# EAGLE design LoRa_1W_Breakout (EAGLE 9.6.2)
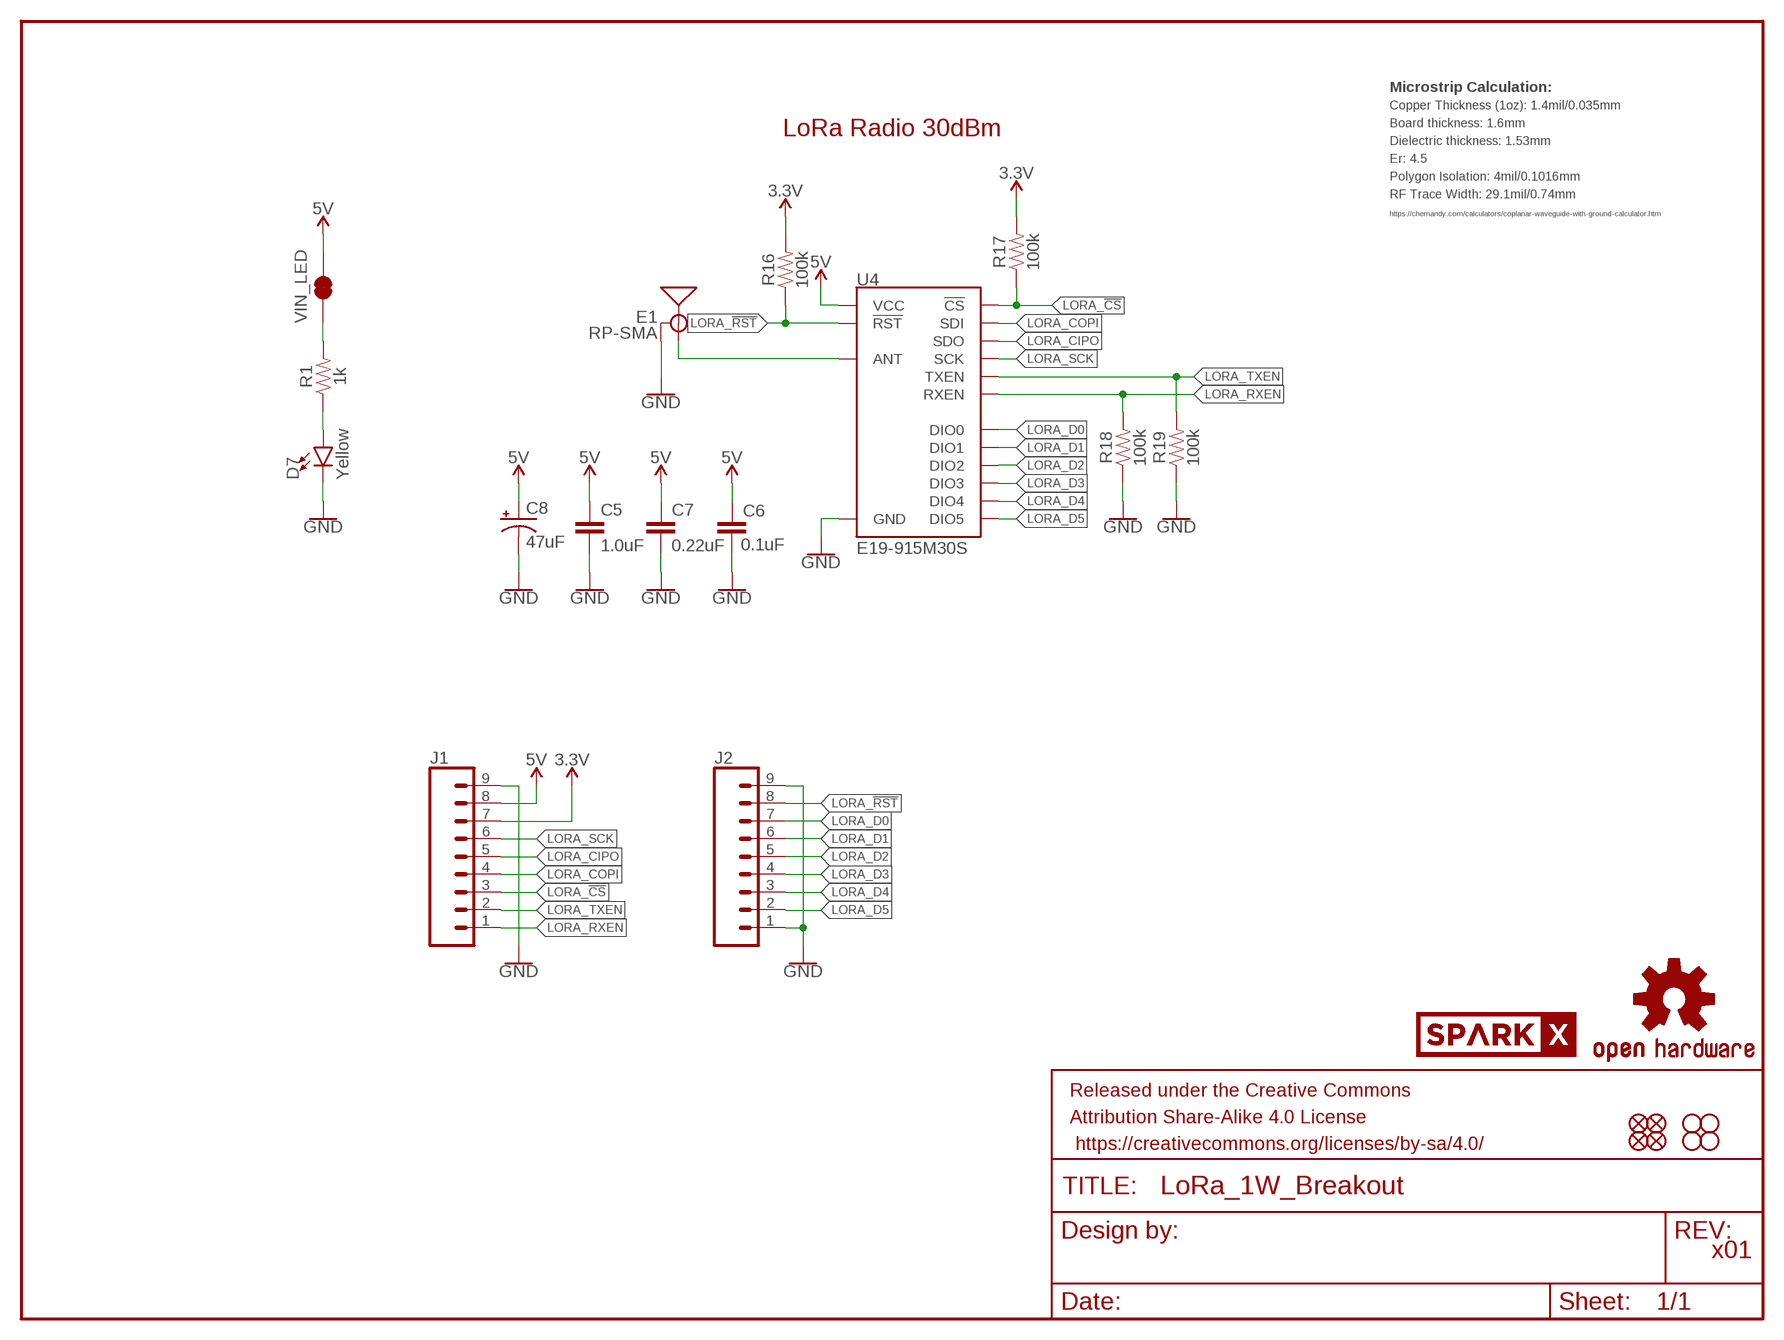
[diagram p0: schematic, sheet 1]

## Parts
C5  1.0uF  1.0UF-0603-16V-10%  [0603]
C6  0.1uF  0.1UF-0603-25V-(+80/-20%)  [0603]
C7  0.22uF  0.22UF-0603-25V-10%  [0603]
C8  47uF  47UF-POLAR-EIA3528-10V-10%  [EIA3528]
D7  Yellow  LED-YELLOW0603  [LED-0603]
E1  RP-SMA  ANTENNA-SMA-GROUNDEDEDGE_RPSMA  [SMA-EDGE]
FD1  FIDUCIALUFIDUCIAL  [FIDUCIAL-MICRO]
FD2  FIDUCIALUFIDUCIAL  [FIDUCIAL-MICRO]
FD3  FIDUCIALUFIDUCIAL  [FIDUCIAL-MICRO]
FD4  FIDUCIALUFIDUCIAL  [FIDUCIAL-MICRO]
FRAME2  FRAME-LETTER  [CREATIVE_COMMONS]
H1  STAND-OFF  [STAND-OFF]
H2  STAND-OFF  [STAND-OFF]
H3  STAND-OFF  [STAND-OFF]
H4  STAND-OFF  [STAND-OFF]
J1  CONN_09NO_SILK  [1X09_NO_SILK]
J2  CONN_09NO_SILK  [1X09_NO_SILK]
LOGO3  OSHW-LOGOMINI  [OSHW-LOGO-MINI]
R1  1k  1KOHM-0603-1/10W-1%  [0603]
R16  100k  100KOHM-0603-1/10W-1%  [0603]
R17  100k  100KOHM-0603-1/10W-1%  [0603]
R18  100k  100KOHM-0603-1/10W-1%  [0603]
R19  100k  100KOHM-0603-1/10W-1%  [0603]
U4  E19-915M30S  E19-915MS1W  [E19-915MS1W]
U$5  SPARKX-LOGO5  [SPARKX-LARGE]
VIN_LED  JUMPER-SMT_2_NC_TRACE_SILK  [SMT-JUMPER_2_NC_TRACE_SILK]

## Nets
3.3V: J1.7 R16.2 R17.2
5V: C5.1 C6.1 C7.1 C8.A(+) J1.8 U4.11(VCC) VIN_LED.2
GND: C5.2 C6.2 C7.2 C8.C(-) D7.C E1.GND@0(GND) E1.GND@1(GND) E1.GND@2(GND) E1.GND@3(GND) J1.9 J2.1 J2.9 R18.1 R19.1 U4.1(GND) U4.9(GND) U4.10(GND) U4.18(GND) U4.20(GND) U4.21(GND) U4.22(GND)
LORA_!CS!: J1.3 R17.1 U4.15(!CS)
LORA_!RST!: J2.8 R16.1 U4.8(!RST)
LORA_CIPO: J1.5 U4.13(SDO)
LORA_COPI: J1.4 U4.14(SDI)
LORA_D0: J2.7 U4.7(DIO0)
LORA_D1: J2.6 U4.6(DIO1)
LORA_D2: J2.5 U4.5(DIO2)
LORA_D3: J2.4 U4.4(DIO3)
LORA_D4: J2.3 U4.3(DIO4)
LORA_D5: J2.2 U4.2(DIO5)
LORA_RF: E1.SIG(SIGNAL) U4.19(ANT)
LORA_RXEN: J1.1 R18.2 U4.17(RXEN)
LORA_SCK: J1.6 U4.12(SCK)
LORA_TXEN: J1.2 R19.2 U4.16(TXEN)
N$8: R1.2 VIN_LED.1
N$9: D7.A R1.1

## Notes on the sheet
- Microstrip Calculation:
- Copper Thickness (1oz): 1.4mil/0.035mm
- LoRa Radio 30dBm | Board thickness: 1.6mm
- Dielectric thickness: 1.53mm
- Er: 4.5
- Polygon Isolation: 4mil/0.1016mm
- RF Trace Width: 29.1mil/0.74mm
- https://chemandy.com/calculators/coplanar-waveguide-with-ground-calculator.htm
- x01

## Library data of the parts
C5 = SparkFun-Capacitors:1.0UF: 1µF ceramic capacitors A capacitor is a passive two-terminal electrical component used to store electrical energy temporarily in an electric field.; PROD_ID: CAP-00868
C6 = SparkFun-Capacitors:0.1UF: 0.1µF ceramic capacitors A capacitor is a passive two-terminal electrical component used to store electrical energy temporarily in an electric field.; PROD_ID: CAP-00810
C7 = SparkFun-Capacitors:0.22UF: 0.22µF ceramic capacitors A capacitor is a passive two-terminal electrical component used to store electrical energy temporarily in an electric field.; PROD_ID: CAP-07822
C8 = SparkFun-Capacitors:47UF-POLAR: 47µF polarized capacitors A capacitor is a passive two-terminal electrical component used to store electrical energy temporarily in an electric field.; PROD_ID: CAP-08310
D7 = SparkFun-LED:LED-YELLOW: Yellow SMD LED Used in manufacturing several products at SparkFun. Packages: 0603 - SMD 0603 package[Product Link] <http://www.kingbrightusa.com/product.asp?catalog_name=LED&product_id=APT1608SYCK> 0603 -SMART - SMART SMD 0603 package (more efficient/more expensive) [Product Link] <http://www.osram-os.com/osram_os/en/products/product-catalog/led-light-emitting-diodes/smartled-0603/ly-l29k/index.jsp> LilyPad - SMD1206 package[Product Datasheet] <https://www.sparkfun.com/datasheets/DevTools/LilyPad/Q150YUS4.pdf> SparkFun Products: Blynk Board <https://www.sparkfun.com/products/13794> IOIO-OTG <https://www.sparkfun.com/products/13613> XBee Explorer Serial <https://www.sparkfun.com/products/13225>; PROD_ID: DIO-09003
E1 = SparkFun-RF:ANTENNA-SMA-GROUNDED: SMA Antenna Connector w/ Ground Edge-mount and SMD SMA connectors for RF Antennas. **4-LAYER BOARD WARNING!!** When designing a 4-layer board using any of the SMD variants, you will need to manually add a cutout polygon on any internal power layers to make sure that you don't end up with exposed copper around the edge of the routed hole for these connectors. Exposed power copper could then short to the connector body - and that would be bad. Why hasn't anyone added the cutout polygons directly to the connector footprint? Well, your internal layers (usually 2 and 15) may be covered with GND polygons and you might well want the copper to go all the way to the edge, especially under the connector SIGNAL pin. So adding cutouts to the footprint might make matters worse, not better...; PROD_ID: CONN-00827
FD1-FD4 = SparkFun-Aesthetics:FIDUCIAL: Fiducial Alignment Points Point-of-reference for pick-and-place machines and other optical instruments.
FRAME2 = SparkFun-Aesthetics:FRAME-LETTER: Schematic Frame - Letter Standard 8.5x11 US Letter frame
H1-H4 = SparkFun-Hardware:STAND-OFF: Stand Off Drill holes for mechanically mounting via screws, standoffs, etc. Note: Use the keepout ring to avoid running the screw head into surrounding components. Variant Overviews STAND-OFF - Mechanical footprint for a #4 phillips button head screw. STAND-OFF-TIGHT - Mechanical footprint for a #4 phillips button head screw, Example SparkFun Products Screw - Phillips Head (1/4", 4-40, 10 pack) <https://www.sparkfun.com/products/10453> (PRT-10453) Screw - Phillips Head (1/2", 4-40, 10 pack) <https://www.sparkfun.com/products/10452> (PRT-10452) Screw - Phillips Head (3/4", 4-40, 10 pack) <https://www.sparkfun.com/products/10451> (PRT-10451) Screw - Phillips Head (1", 4-40, 10 pack) <https://www.sparkfun.com/products/10450> (PRT-10450)
J1 J2 = SparkFun-Connectors:CONN_09: Multi connection point. Often used as Generic Header-pin footprint for 0.1 inch spaced/style header connections On any of the 0.1 inch spaced packages, you can populate with these: Break Away Headers - Straight <https://www.sparkfun.com/products/116> (PRT-00116) Break Away Male Headers - Right Angle <https://www.sparkfun.com/products/553> (PRT-00553) Female Headers <https://www.sparkfun.com/products/115> (PRT-00115) Break Away Headers - Machine Pin <https://www.sparkfun.com/products/117> (PRT-00117) Break Away Female Headers - Swiss Machine Pin <https://www.sparkfun.com/products/743> (PRT-00743) For SCREWTERMINALS and SPRING TERMINALS visit here: Screw Terimnals on SparkFun.com <https://www.sparkfun.com/search/results?term=Screw+Terminals> (5mm/3.5mm/2.54mm spacing) This device is also useful as a general connection point to wire up your design to another part of your project. Our various solder wires solder well into these plated through hole pads. Hook-Up Wire - Assortment (Stranded, 22 AWG) <https://www.sparkfun.com/products/11375> (PRT-11375) Hook-Up Wire - Assortment (Solid Core, 22 AWG) <https://www.sparkfun.com/products/11367> (PRT-11367) View the entire wire category on our website here <https://www.sparkfun.com/categories/141> Special notes: Molex polarized connector foot print use with SKU : PRT-08231 with associated crimp pins and housings. 1MM SMD Version SKU: PRT-10208 NOTES ON THE VARIANTS LOCK and LOCK_LONGPADS... This footprint was designed to help hold the alignment of a through-hole component (i.e. 6-pin header) while soldering it into place. You may notice that each hole has been shifted either up or down by 0.005 of an inch from it's more standard position (which is a perfectly straight line). This slight alteration caused the pins (the squares in the middle) to touch the edges of the holes. Because they are alternating, it causes a "brace" to hold the component in place. 0.005 has proven to be the perfect amount of "off-center" position when using our standard breakaway headers. Although looks a little odd when you look at the bare footprint, once you have a header in there, the alteration is very hard to notice. Also,if you push a header all the way into place, it is covered up entirely on the bottom side.
LOGO3 = SparkFun-Aesthetics:OSHW-LOGO: Open-Source Hardware (OSHW) Logo This logo indicates the piece of hardware it is found on incorporates a OSHW license and/or adheres to the definition of open source hardware found here: http://freedomdefined.org/OSHW
R1 = SparkFun-Resistors:1KOHM: 1kΩ resistor A resistor is a passive two-terminal electrical component that implements electrical resistance as a circuit element. Resistors act to reduce current flow, and, at the same time, act to lower voltage levels within circuits. - Wikipedia; PROD_ID: RES-07856
R16-R19 = SparkFun-Resistors:100KOHM: 100kΩ resistor A resistor is a passive two-terminal electrical component that implements electrical resistance as a circuit element. Resistors act to reduce current flow, and, at the same time, act to lower voltage levels within circuits. - Wikipedia; PROD_ID: RES-07828
U4 = SparkFun-RF:E19-915MS1W: Chengdu Ebyte E19-915M30S - 915M LoRa (FSK) TRX Using SX1276 This is a 915 MHz LoRa (or optionally FSK) modulated transciver bassed on the Semtech SX1276. It has a high ouput power of 1W an a pre-installed U.FL connector. Can be used with LoRa WAN with DIO0, DIO1, and DIO2 hooked up to controller interrupt inputs SparkFun Products: SAMD21 Pro RF 1W <https://www.sparkfun.com/products/15034>; PROD_ID: IC-14076
U$5 = SparkX:SPARKX-LOGO
VIN_LED = SparkFun-Jumpers:JUMPER-SMT_2_NC_TRACE: Normally closed trace jumper This jumper has a trace between two pads so it's normally closed (NC). Use a razor knife to open the connection. For best results follow the IPC guidelines for cutting traces: Cutout at least 0.063 mm (0.005 in). Remove all loose material to clean up the cut area. Seal the cut with an approved epoxy. Reapply solder to reclose the connection.

## Net classes
0 default: width 0 mm, drill 0 mm
1 vcc: width 0 mm

## Board
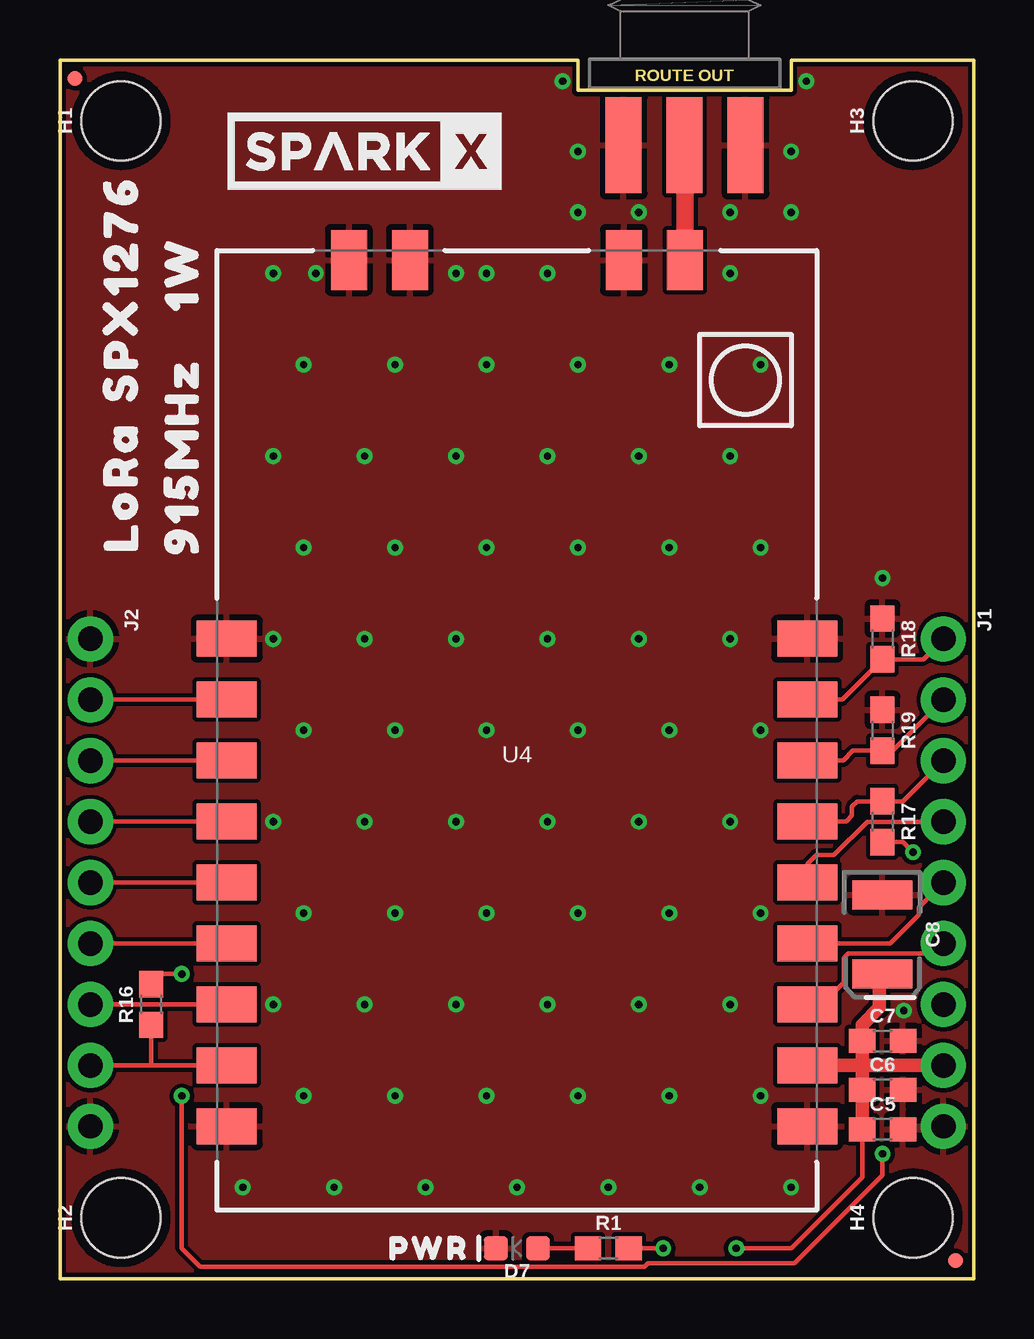
[diagram p1: board, top side]
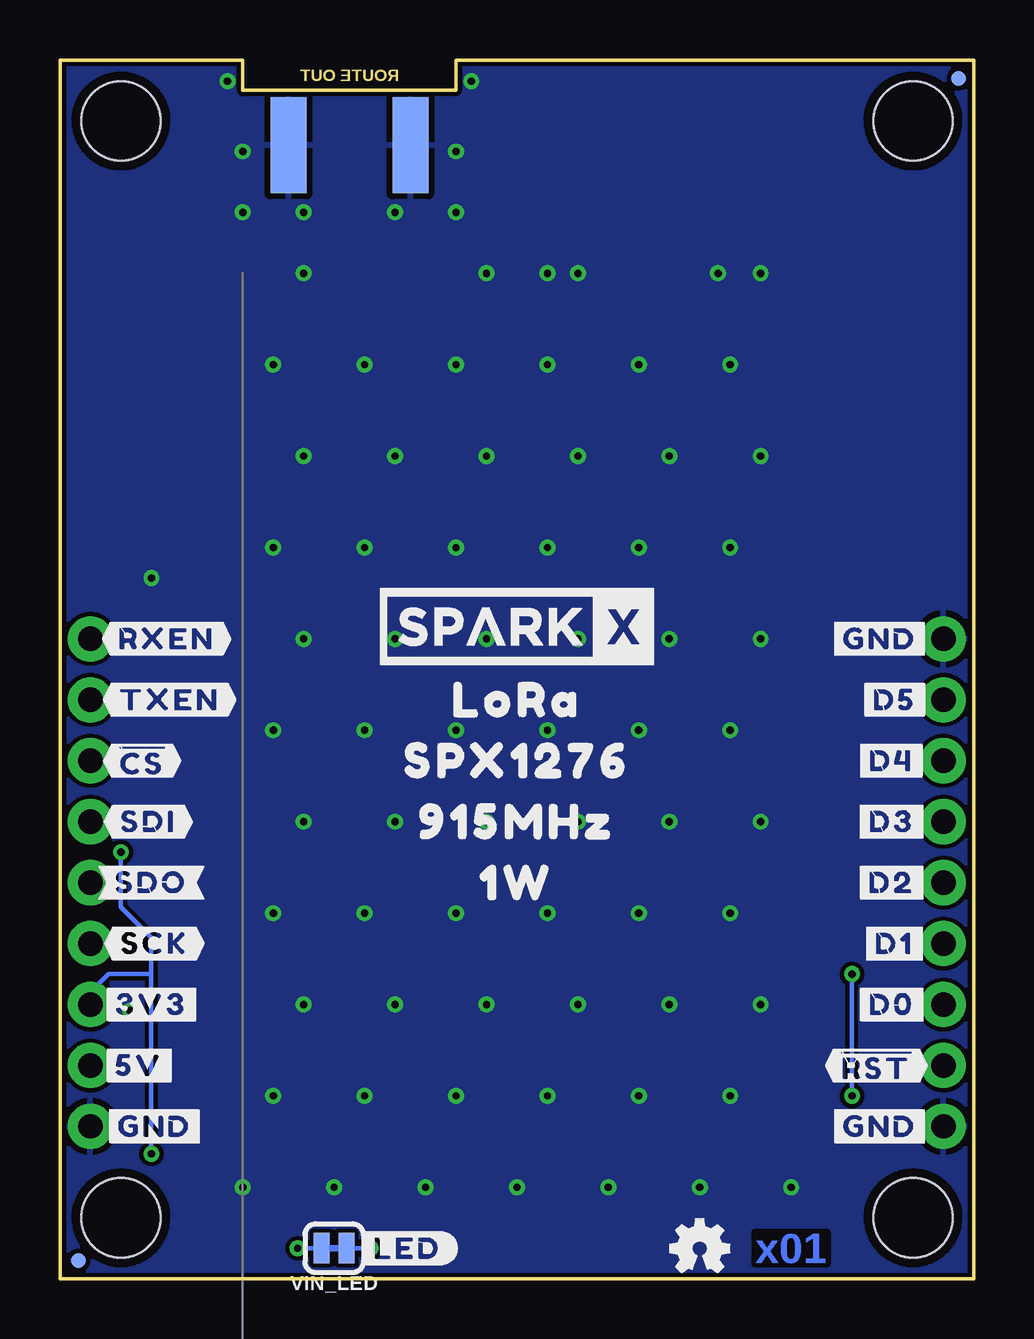
[diagram p2: board, bottom side, seen from below]

Size 38.1 x 50.8 mm. Coordinates in mm from the lower left corner, seen from the top.
Outline: 38.1,0 0,0 0,50.8 21.59,50.8 21.59,49.53 30.48,49.53 30.48,50.8 38.1,50.8 38.1,0
Copper layers (1*16): Top 0.035mm / dielectric 1.5mm / Bottom 0.035mm
Design rules "SparkFun-2-layer-TIGHT *": minimum track width 7mil, minimum drill 12mil, track to track 7mil, track to pad 7mil, pad to pad 7mil, via to via 7mil, smd to smd 7mil, copper to edge 7mil, drill to drill 7mil, minimum pad ring 7mil, minimum via ring 7mil, stop-mask expansion 4mil, vias tented up to drill 25mil, thermal gap 10mil

### Footprints (pad centres in the part's own frame; a part is rotated, then mirrored left to right if it is on the bottom)
0603 = smd 1.1 x 1: 1 -0.85,0; 2 0.85,0
EIA3528 = smd 1.2 x 2.5: A 1.65,0; C -1.65,0
LED-0603 = smd 1 x 1: A -0.877,0; C 0.877,0
SMA-EDGE = smd 1.5 x 4: GND@0 -2.54,0; GND@1 2.54,0; SIG 0,0 | smd 1.5 x 4 bottom: GND@2 -2.54,0; GND@3 2.54,0
FIDUCIAL-MICRO = smd 0.635 x 0.635: 1 0,0
STAND-OFF = hole 3.302: 0,0
1X09_NO_SILK = drill 1.016 pad 1.88: 1 0,0; 2 2.54,0; 3 5.08,0; 4 7.62,0; 5 10.16,0; 6 12.7,0; 7 15.24,0; 8 17.78,0; 9 20.32,0
E19-915MS1W = smd 2.5 x 1.5: 1 12.1,-3.82; 2 12.1,-1.28; 3 12.1,1.26; 4 12.1,3.8; 5 12.1,6.34; 6 12.1,8.88; 7 12.1,11.42; 8 12.1,13.96; 9 12.1,16.5; 10 -12.1,16.5; 11 -12.1,13.96; 12 -12.1,11.42; 13 -12.1,8.88; 14 -12.1,6.34; 15 -12.1,3.8; 16 -12.1,1.26; 17 -12.1,-1.28; 18 -12.1,-3.82 | smd 1.5 x 2.5: 19 -7,-19.6; 20 -4.46,-19.6; 21 4.46,-19.6; 22 7,-19.6
SMT-JUMPER_2_NC_TRACE_SILK = smd 0.66 x 1.27: 1 -0.521,0; 2 0.521,0

### Placement (x,y rotation side)
C5  34.29,6.22 0 top
C6  34.29,7.87 0 top
C7  34.29,9.91 0 top
C8  34.29,14.35 270 top
D7  19.05,1.27 180 top
E1  26.04,47.24 0 top
FD1  37.34,0.76 90 top
FD2  0.64,50.04 90 top
FD3  37.34,0.76 270 bottom
FD4  0.64,50.04 270 bottom
FRAME2  -1.27,-11.43 0 top  (outside the outline)
H1  2.54,48.26 90 top
H2  2.54,2.54 90 top
H3  35.56,48.26 90 top
H4  35.56,2.54 90 top
J1  36.83,26.67 270 top
J2  1.27,26.67 270 top
LOGO3  11.43,1.27 0 bottom
R1  22.86,1.27 0 top
R16  3.81,11.43 90 top
R17  34.29,19.05 270 top
R18  34.29,26.67 270 top
R19  34.29,22.86 270 top
U4  19.05,22.86 180 top
U$1  [LORA0]  19.05,24.13 0 bottom
U$2  [SPX12760]  19.05,21.59 0 bottom
U$3  [1W1]  19.05,16.51 0 bottom
U$4  [PWR0]  15.37,1.27 0 top
U$5  12.7,46.99 0 top
U$6  SPARKX-LOGO5  [SPARKX-LARGE]  19.05,27.18 0 bottom
U$7  [915MHZ0]  5.08,34.29 90 top
U$8  [915MHZ0]  19.05,19.05 0 bottom
U$15  [#LED#0]  23.62,1.27 0 bottom
U$27  [1W1]  5.08,41.91 90 top
U$43  [#5V#1]  34.8,8.89 0 bottom
U$44  [#3V3#0]  34.29,11.43 0 bottom
U$45  [#SDO#3]  34.29,16.51 0 bottom
U$46  [#SDI#4]  34.42,19.05 0 bottom
U$47  [##CS##5]  34.67,21.59 0 bottom
U$48  [#TXEN#6]  33.53,24.13 0 bottom
U$49  [#RXEN#7]  33.66,26.67 0 bottom
U$52  [#GND#8]  34.16,6.35 0 bottom
U$53  [#GND#8]  3.94,26.67 0 bottom
U$54  [#D5#6]  3.3,24.13 0 bottom
U$55  [#D4#5]  3.43,21.59 0 bottom
U$56  [#D3#4]  3.43,19.05 0 bottom
U$57  [#D2#3]  3.43,16.51 0 bottom
U$58  [#D1#2]  3.3,13.97 0 bottom
U$59  [#D0#1]  3.43,11.43 0 bottom
U$60  [##RST##0]  4.06,8.89 0 bottom
U$61  [#GND#8]  3.94,6.35 0 bottom
U$62  [#SCK#2]  34.16,13.97 0 bottom
U$67  [LORA0]  2.54,33.02 90 top
U$69  [SPX12760]  2.54,41.27 90 top
VIN_LED  26.67,1.27 180 bottom

### Tracks (layer width: path | path; a pad name or v marks a point on that pad's centre or on a via)
3.3V  (via drill 0.3)
  Top 0.178: v5.08,12.7 4.23,12.7 R16.2 | R17.2 35.14,18.2 v35.56,17.78 | v34.29,5.21 34.29,4.32 30.61,0.64 24.5,0.64 24.37,0.5 5.85,0.5 5.08,1.27 v5.08,7.62
  Bottom 0.178: v5.08,7.62 v5.08,12.7 | 34.29,12.7 v34.29,5.21 | v35.56,17.78 35.56,15.49 34.29,14.22 34.29,12.7 | J1.7 36.83,11.94 36.07,12.7 34.29,12.7
5V  (via drill 0.3)
  Top 0.178: C5.1 33.44,4.23 30.48,1.27 v28.19,1.27
  Top 0.559: 33.4,8.9 U4.11 | 33.44,8.94 C7.1 33.44,10.58 34.16,11.3 34.16,12.57 C8.A | 33.44,8.94 33.4,8.9 | 33.44,8.94 C6.1 C5.1 | J1.8 33.4,8.9
  Bottom 0.178: v28.19,1.27 VIN_LED.2
GND  (via drill 0.3)
  other vias: 29.21,7.62 30.48,3.81 26.67,3.81 22.86,3.81 19.05,3.81 15.24,3.81 11.43,3.81 7.62,3.81 25.4,7.62 21.59,7.62 17.78,7.62 13.97,7.62 10.16,7.62 27.94,11.43 24.13,11.43 20.32,11.43 16.51,11.43 12.7,11.43 8.89,11.43 29.21,15.24 25.4,15.24 21.59,15.24 17.78,15.24 13.97,15.24 10.16,15.24 27.94,19.05 24.13,19.05 20.32,19.05 16.51,19.05 12.7,19.05 8.89,19.05 29.21,22.86 25.4,22.86 21.59,22.86 17.78,22.86 13.97,22.86 10.16,22.86 27.94,26.67 24.13,26.67 20.32,26.67 16.51,26.67 12.7,26.67 8.89,26.67 29.21,30.48 25.4,30.48 21.59,30.48 17.78,30.48 13.97,30.48 10.16,30.48 27.94,34.29 24.13,34.29 20.32,34.29 16.51,34.29 12.7,34.29 8.89,34.29 20.95,49.91 21.59,46.99 24.13,44.45 20.32,41.91 27.94,41.91 21.59,44.45 30.48,44.45 27.94,44.45 30.48,46.99 31.11,49.91 16.51,41.91 8.89,41.91 17.78,41.91 10.67,41.91 34.29,29.21 29.21,38.1 25.4,38.1 21.59,38.1 17.78,38.1 13.97,38.1 10.16,38.1 35.18,11.18
  pour Bottom (isolate 0.102): 0,0 0,50.8 38.1,50.8 38.1,0
  pour Top (isolate 0.102): 0,0 0,50.8 38.1,50.8 38.1,0
LORA_!CS!
  Top 0.178: U4.15 32.78,19.06 33.02,19.3 33.02,19.68 33.23,19.9 R17.1 35.14,19.9 J1.3
LORA_!RST!
  Top 0.178: J2.8 3.81,8.89 | 3.81,8.89 7.62,8.89 7.61,8.9 U4.8 | R16.1 3.81,8.89
LORA_CIPO
  Top 0.178: J1.5 35.81,15.49 35.81,15.16 34.62,13.98 U4.13
LORA_COPI
  Top 0.178: U4.14 31.15,17.28 31.53,17.66 32.27,17.66 33.66,19.05 J1.4
LORA_D0
  Top 0.178: J2.7 7.62,11.43 7.61,11.44 U4.7
LORA_D1
  Top 0.178: J2.6 U4.6
LORA_D2
  Top 0.178: J2.5 U4.5
LORA_D3
  Top 0.178: J2.4 U4.4
LORA_D4
  Top 0.178: J2.3 U4.3
LORA_D5
  Top 0.178: J2.2 U4.2
LORA_RF
  Top 0.739: E1.SIG 26.05,47.23 U4.19
LORA_RXEN
  Top 0.178: U4.17 32.61,24.14 R18.2 35.98,25.82 J1.1
LORA_SCK
  Top 0.178: J1.6 36.43,13.57 32.87,13.57 32.67,13.36 32.67,12.36 31.75,11.44 U4.12
LORA_TXEN
  Top 0.178: U4.16 32.65,21.6 33.06,22.01 R19.2 34.71,22.01 J1.2
N$8  (via drill 0.3)
  Top 0.178: v25.15,1.27 R1.2
  Bottom 0.178: VIN_LED.1 v25.15,1.27
N$9
  Top 0.178: R1.1 D7.A

### Text on the board
Bottom: x01
Dimension: ROUTE OUT